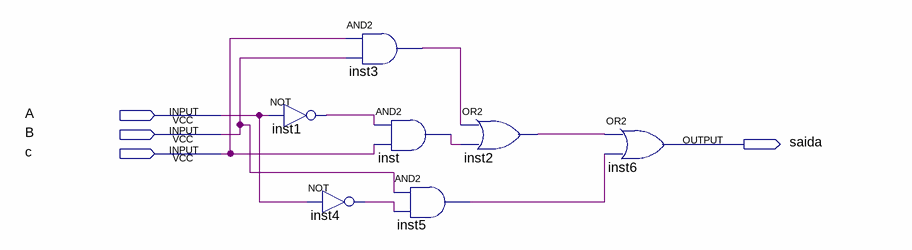
[diagram p0: schematic sheet]
// Quartus schematic comp_ma_1bit.bdf as structural Verilog: 7 symbols, 4 pins
module comp_ma_1bit (
  input  A,
  input  B,
  input  c,
  output saida
);

  wire inst1_out, inst2_out, inst3_out, inst4_out, inst5_out, inst_out;

  not inst1 (inst1_out, A);
  and inst3 (inst3_out, c, B);
  and inst (inst_out, inst1_out, c);
  not inst4 (inst4_out, A);
  and inst5 (inst5_out, B, inst4_out);
  or inst2 (inst2_out, inst3_out, inst_out);
  or inst6 (saida, inst2_out, inst5_out);
endmodule
